# EAGLE schematic PDP8S (EAGLE 6.6.0)

## Sheet 1 of 2
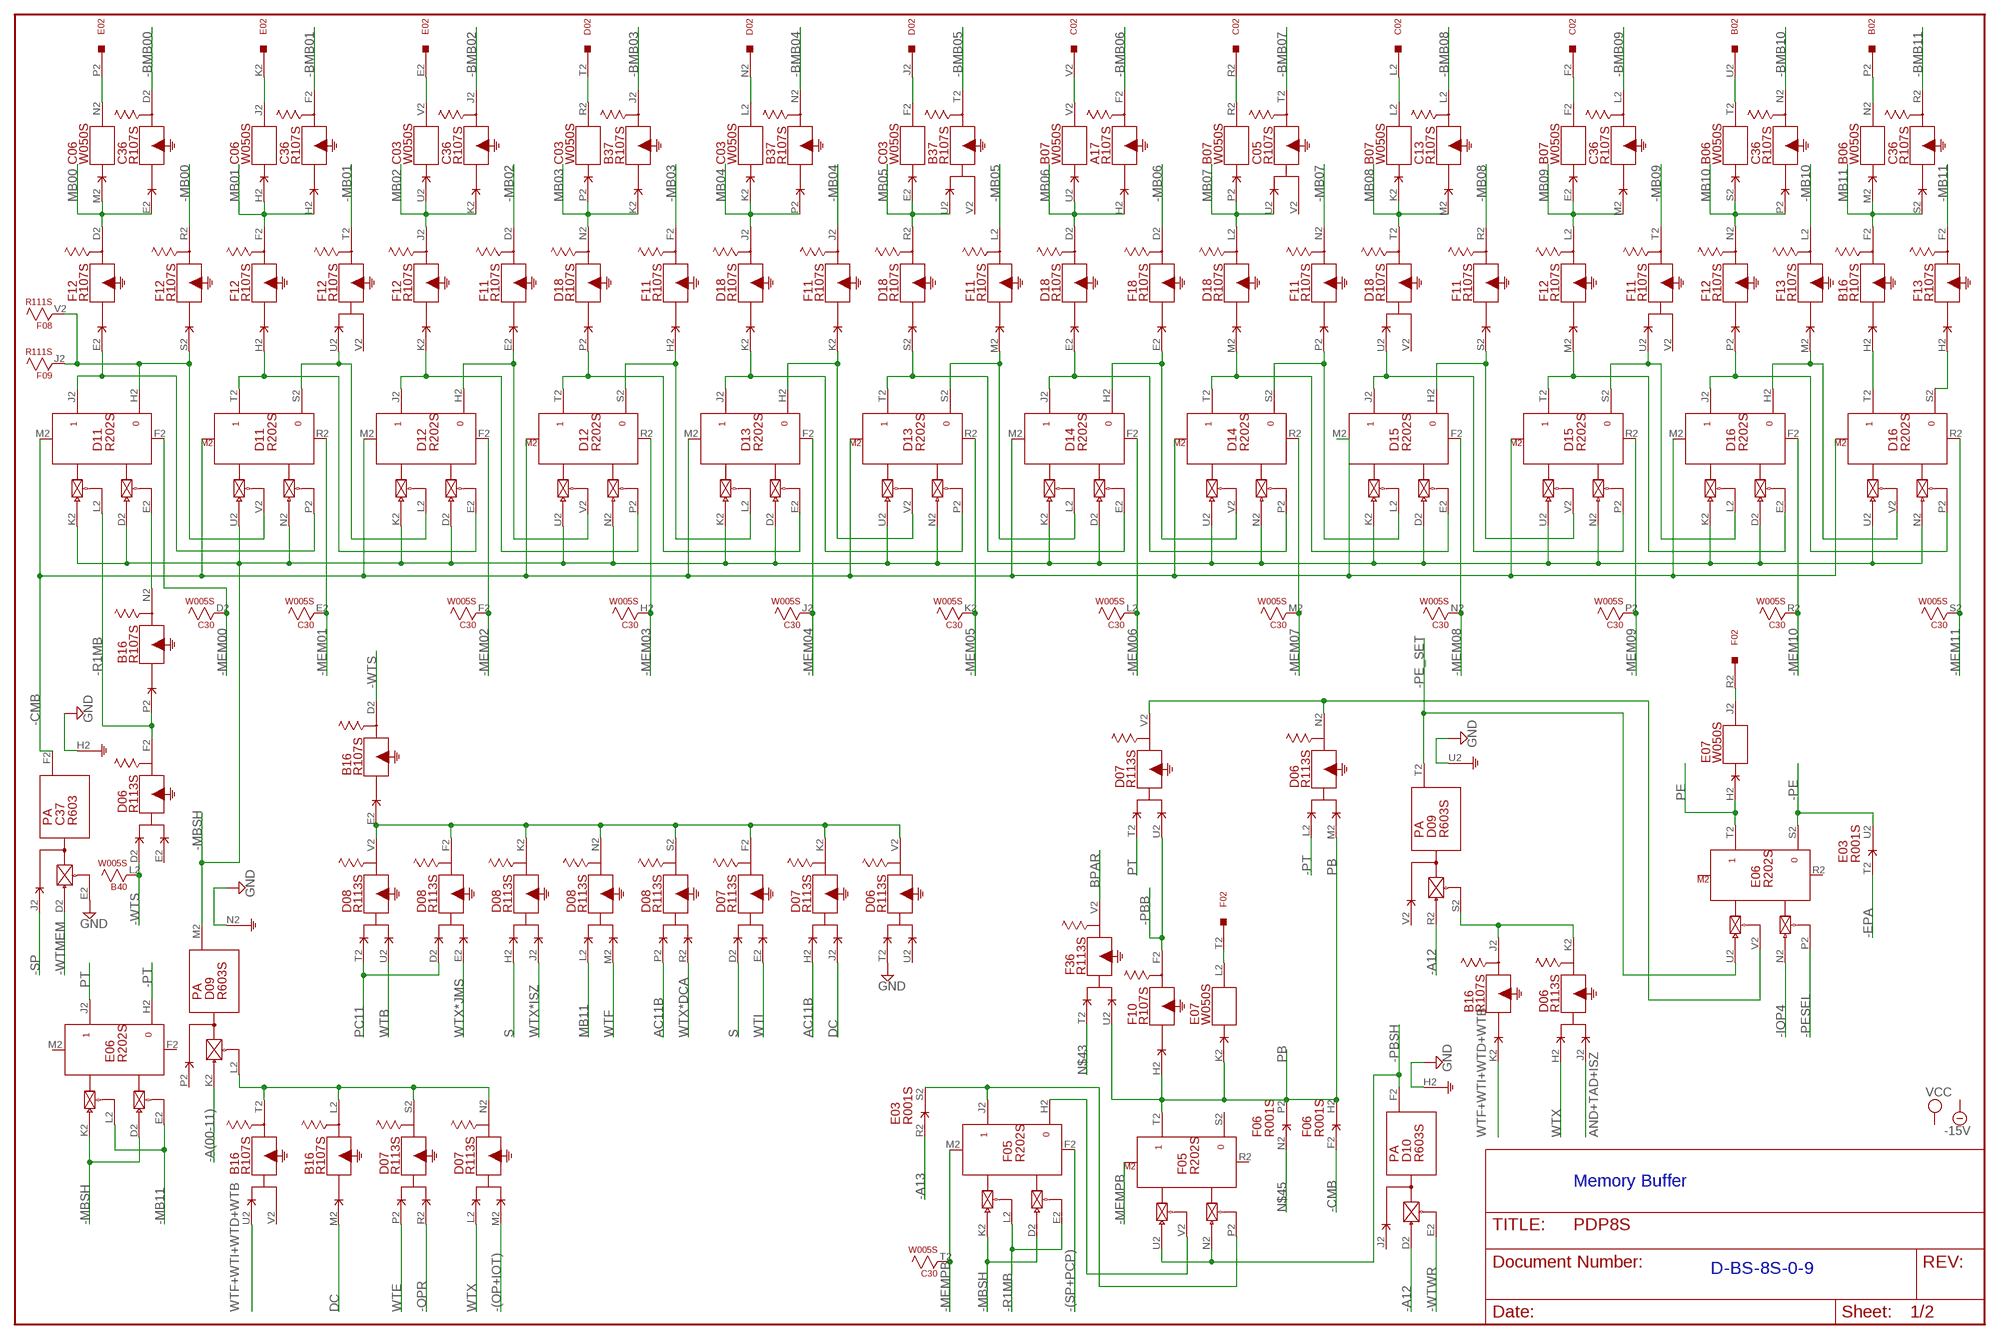
[diagram p0: schematic, sheet 1]

### Parts
A17  R107S  [H807S]
B02  W023S  [H807S]
B06  W050S  [H807S]
B07  W050S  [H807S]
B16  R107S  [H807S]
B37  R107S  [H807S]
B40  W005S  [H807S]
C02  W023S  [H807S]
C03  W050S  [H807S]
C05  R107S  [H807S]
C06  W050S  [H807S]
C13  R107S  [H807S]
C30  W005S  [H807S]
C36  R107S  [H807S]
C37  R603  [H807]
D02  W023S  [H807S]
D06  R113S  [H807S]
D07  R113S  [H807S]
D08  R113S  [H807S]
D09  R603S  [H807S]
D10  R603S  [H807S]
D11  R202S  [H807S]
D12  R202S  [H807S]
D13  R202S  [H807S]
D14  R202S  [H807S]
D15  R202S  [H807S]
D16  R202S  [H807S]
D18  R107S  [H807S]
E02  W023S  [H807S]
E03  R001S  [H807S]
E06  R202S  [H807S]
E07  W050S  [H807S]
F02  W023S  [H807S]
F05  R202S  [H807S]
F06  R001S  [H807S]
F08  R111S  [H807S]
F09  R111S  [H807S]
F10  R107S  [H807S]
F11  R107S  [H807S]
F12  R107S  [H807S]
F13  R107S  [H807S]
F18  R107S  [H807S]
F36  R113S  [H807S]

### Nets
-(OP+IOT): D07.M2(N:I$2)
-(SP+PCP): F05.F2(J:RESET)
-A12: D09.R2(T:PU0) D10.D2(F:PU0)
-A13: E03.R2(S:D)
-A(00-11): D09.K2(M:PU0)
-BMB00: C36.D2(D:O$1)
-BMB01: C36.F2(F:O$1)
-BMB02: C36.J2(J:O$1)
-BMB03: B37.J2(J:O$1)
-BMB04: B37.N2(N:O$1)
-BMB05: B37.T2(T:O$1)
-BMB06: A17.F2(F:O$1)
-BMB07: C05.T2(T:O$1)
-BMB08: C13.L2(L:O$1)
-BMB09: C36.L2(L:O$1)
-BMB10: C36.N2(N:O$1)
-BMB11: C36.R2(R:O$1)
-CMB: C37.F2(F:O) D11.M2(J:SET) D12.M2(J:SET) D13.M2(J:SET) D14.M2(J:SET) D15.M2(J:SET) D16.M2(J:SET) F06.F2(H:D)
-EPA: E03.T2(U:D)
-IOP4: E06.N2(T:PU0)
-MB00: F12.R2(R:O$1)
-MB01: F12.T2(T:O$1)
-MB02: F11.D2(D:O$1)
-MB03: F11.F2(F:O$1)
-MB04: F11.J2(J:O$1)
-MB05: F11.L2(L:O$1)
-MB06: F18.D2(D:O$1)
-MB07: F11.N2(N:O$1)
-MB08: F11.R2(R:O$1)
-MB09: F11.T2(T:O$1)
-MB10: F13.L2(L:O$1)
-MB11: E06.E2(J:EN0) E06.L2(J:EN1) F13.F2(F:O$1)
-MBSH: D09.M2(M:O) D11.D2(J:PU0) D11.K2(J:PU1) D11.N2(T:PU0) D11.U2(T:PU1) D12.D2(J:PU0) D12.K2(J:PU1) D12.N2(T:PU0) D12.U2(T:PU1) D13.D2(J:PU0) D13.K2(J:PU1) D13.N2(T:PU0) D13.U2(T:PU1) D14.D2(J:PU0) D14.K2(J:PU1) D14.N2(T:PU0) D14.U2(T:PU1) D15.D2(J:PU0) D15.K2(J:PU1) D15.N2(T:PU0) D15.U2(T:PU1) D16.D2(J:PU0) D16.K2(J:PU1) D16.N2(T:PU0) D16.U2(T:PU1) E06.D2(J:PU0) E06.K2(J:PU1) F05.D2(J:PU0) F05.K2(J:PU1)
-MEM00: C30.D2 D11.F2(J:RESET)
-MEM01: C30.E2 D11.R2(T:RESET)
-MEM02: C30.F2 D12.F2(J:RESET)
-MEM03: C30.H2 D12.R2(T:RESET)
-MEM04: C30.J2 D13.F2(J:RESET)
-MEM05: C30.K2 D13.R2(T:RESET)
-MEM06: C30.L2 D14.F2(J:RESET)
-MEM07: C30.M2 D14.R2(T:RESET)
-MEM08: C30.N2 D15.F2(J:RESET)
-MEM09: C30.P2 D15.R2(T:RESET)
-MEM10: C30.R2 D16.F2(J:RESET)
-MEM11: C30.S2 D16.R2(T:RESET)
-MEMPB: C30.T2 F05.M2(J:SET)
-OPR: D07.R2(S:I$2)
-PBB: D07.U2(V:I$2) F10.F2(F:O$1)
-PBSH: D10.F2(F:O) F05.N2(T:PU0) F05.U2(T:PU1)
-PE: E03.U2(U:E) E06.S2
-PE_SET: D09.T2(T:O) E06.U2(T:PU1)
-PESEL: E06.P2(T:EN0)
-PT: D06.L2(N:I$1) E06.H2
-R1MB: B16.P2(N:I$1) D06.F2(F:O$1) D11.L2(J:EN1) F05.E2(J:EN0) F05.L2(J:EN1)
-SP: C37.J2(F:I$1)
-WTMEM: C37.D2(F:PU0)
-WTS: B16.D2(D:O$1) B40.L2 D06.D2(F:I$1)
-WTWR: D10.E2(F:EN0)
AC11B: D07.H2(K:I$1) D08.P2(S:I$1)
AND+TAD+ISZ: D06.J2(K:I$2)
BPAR: F36.V2(V:O$1)
DC: B16.M2(L:I$1) D07.J2(K:I$2)
GND [Supply]: C37.E2(F:EN0) C37.H2(F:G) D06.T2(V:I$1) D09.N2(M:G) D09.U2(T:G) D10.H2(F:G)
MB00: C06.M2(N:I$1) C36.E2(D:I$1) F12.D2(D:O$1)
MB01: C06.H2(J:I$1) C36.H2(F:I$1) F12.F2(F:O$1)
MB02: C03.U2(V:I$1) C36.K2(J:I$1) F12.J2(J:O$1)
MB03: B37.K2(J:I$1) C03.P2(R:I$1) D18.N2(N:O$1)
MB04: B37.P2(N:I$1) C03.K2(L:I$1) D18.J2(J:O$1)
MB05: B37.U2(T:I$1) C03.E2(F:I$1) D18.R2(R:O$1)
MB06: A17.H2(F:I$1) B07.U2(V:I$1) D18.D2(D:O$1)
MB07: B07.P2(R:I$1) C05.U2(T:I$1) D18.L2(L:O$1)
MB08: B07.K2(L:I$1) C13.M2(L:I$1) D18.T2(T:O$1)
MB09: B07.E2(F:I$1) C36.M2(L:I$1) F12.L2(L:O$1)
MB10: B06.S2(T:I$1) C36.P2(N:I$1) F12.N2(N:O$1)
MB11: B06.M2(N:I$1) B16.F2(F:O$1) C36.S2(R:I$1) D08.L2(N:I$1)
N$1: D11.J2 D11.P2(T:EN0) F12.E2(D:I$1)
N$2: C06.N2(N:O$1) E02.P2
N$3: D11.H2 D11.V2(T:EN1) F08.V2 F09.J2 F12.S2(R:I$1)
N$4: D11.T2 D12.E2(J:EN0) F12.H2(F:I$1)
N$5: B16.E2(D:I$1) D06.V2(V:O$1) D07.F2(F:O$1) D07.K2(K:O$1) D08.F2(F:O$1) D08.K2(K:O$1) D08.N2(N:O$1) D08.S2(S:O$1) D08.V2(V:O$1)
N$6: D12.J2 D12.P2(T:EN0) F12.K2(J:I$1)
N$7: D12.T2 D13.E2(J:EN0) D18.P2(N:I$1)
N$8: D13.J2 D13.P2(T:EN0) D18.K2(J:I$1)
N$9: D13.T2 D14.E2(J:EN0) D18.S2(R:I$1)
N$10: D14.J2 D14.P2(T:EN0) D18.E2(D:I$1)
N$11: D14.T2 D15.E2(J:EN0) D18.M2(L:I$1)
N$12: D15.J2 D15.P2(T:EN0) D18.U2(T:I$1)
N$13: D15.H2 D15.V2(T:EN1) F11.S2(R:I$1)
N$14: D14.S2 D15.L2(J:EN1) F11.P2(N:I$1)
N$15: D14.H2 D14.V2(T:EN1) F18.E2(D:I$1)
N$16: D13.S2 D14.L2(J:EN1) F11.M2(L:I$1)
N$17: D15.T2 D16.E2(J:EN0) F12.M2(L:I$1)
N$18: D15.S2 D16.L2(J:EN1) F11.U2(T:I$1)
N$19: D16.J2 D16.P2(T:EN0) F12.P2(N:I$1)
N$20: D13.H2 D13.V2(T:EN1) F11.K2(J:I$1)
N$21: D12.S2 D13.L2(J:EN1) F11.H2(F:I$1)
N$22: D12.H2 D12.V2(T:EN1) F11.E2(D:I$1)
N$23: D11.S2 D12.L2(J:EN1) F12.U2(T:I$1)
N$24: D16.H2 D16.V2(T:EN1) F13.M2(L:I$1)
N$25: B16.H2(F:I$1) D16.T2
N$26: D16.S2 F13.H2(F:I$1)
N$27: C06.J2(J:O$1) E02.K2
N$28: C03.V2(V:O$1) E02.E2
N$29: C03.R2(R:O$1) D02.T2
N$30: C03.L2(L:O$1) D02.N2
N$31: C03.F2(F:O$1) D02.J2
N$32: B07.V2(V:O$1) C02.V2
N$33: B07.R2(R:O$1) C02.R2
N$34: B07.L2(L:O$1) C02.L2
N$35: B07.F2(F:O$1) C02.F2
N$36: B02.U2 B06.T2(T:O$1)
N$37: B02.P2 B06.N2(N:O$1)
N$38: B16.L2(L:O$1) B16.T2(T:O$1) D07.N2(N:O$1) D07.S2(S:O$1) D09.L2(M:EN0)
N$39: B16.N2(N:O$1) D11.E2(J:EN0)
N$40: B16.J2(J:O$1) D06.K2(K:O$1) D09.S2(T:EN0)
N$41: E07.J2(J:O$1) F02.R2
N$42: D06.N2(N:O$1) D07.V2(V:O$1) E06.V2(T:EN1)
N$43: F36.T2(V:I$1)
N$44: E07.L2(L:O$1) F02.T2
N$45: F06.N2(P:D)
N$46: F05.H2 F05.V2(T:EN1)
N$47: E03.S2(S:E) F05.J2 F05.P2(T:EN0)
PB: D06.M2(N:I$2) E07.K2(L:I$1) F05.T2 F06.H2(H:E) F06.P2(P:E) F10.H2(F:I$1) F36.U2(V:I$2)
PC11: D08.D2(F:I$1) D08.T2(V:I$1)
PE: E06.T2 E07.H2(J:I$1)
PT: D07.T2(V:I$1) E06.J2
S: D07.D2(F:I$1) D08.H2(K:I$1)
WTB: D08.U2(V:I$2)
WTE: D07.P2(S:I$1)
WTF: D08.M2(N:I$2)
WTF+WTI+WTD+WTB: B16.K2(J:I$1) B16.U2(T:I$1)
WTI: D07.E2(F:I$2)
WTX: D06.H2(K:I$1) D07.L2(N:I$1)
WTX*DCA: D08.R2(S:I$2)
WTX*ISZ: D08.J2(K:I$2)
WTX*JMS: D08.E2(F:I$2)
Unconnected: A17.D2(D:O$1) A17.E2(D:I$1) A17.J2(J:O$1) A17.K2(J:I$1) A17.L2(L:O$1) A17.M2(L:I$1) A17.N2(N:O$1) A17.P2(N:I$1) A17.R2(R:O$1) A17.S2(R:I$1) A17.T2(T:O$1) A17.U2(T:I$1) A17.V2(T:I$2) B02.A2 B02.B2 B02.C2 B02.D2 B02.E2 B02.F2 B02.H2 B02.J2 B02.K2 B02.L2 B02.M2 B02.N2 B02.R2 B02.S2 B02.T2 B02.V2 B06.E2(F:I$1) B06.F2(F:O$1) B06.H2(J:I$1) B06.J2(J:O$1) B06.K2(L:I$1) B06.L2(L:O$1) B06.P2(R:I$1) B06.R2(R:O$1) B06.U2(V:I$1) B06.V2(V:O$1) B07.H2(J:I$1) B07.J2(J:O$1) B07.M2(N:I$1) B07.N2(N:O$1) B07.S2(T:I$1) B07.T2(T:O$1) B16.R2(R:O$1) B16.S2(R:I$1) B16.V2(T:I$2) B37.D2(D:O$1) B37.E2(D:I$1) B37.F2(F:O$1) B37.H2(F:I$1) B37.L2(L:O$1) B37.M2(L:I$1) B37.R2(R:O$1) B37.S2(R:I$1) B37.V2(T:I$2) B40.D2 B40.E2 B40.F2 B40.H2 B40.J2 B40.K2 B40.M2 B40.N2 B40.P2 B40.R2 B40.S2 B40.T2 B40.U2 B40.V2 C02.A2 C02.B2 C02.C2 C02.D2 C02.E2 C02.H2 C02.J2 C02.K2 C02.M2 C02.N2 C02.P2 C02.S2 C02.T2 C02.U2 C03.H2(J:I$1) C03.J2(J:O$1) C03.M2(N:I$1) C03.N2(N:O$1) C03.S2(T:I$1) C03.T2(T:O$1) C05.D2(D:O$1) C05.E2(D:I$1) C05.F2(F:O$1) C05.H2(F:I$1) C05.J2(J:O$1) C05.K2(J:I$1) C05.L2(L:O$1) C05.M2(L:I$1) C05.N2(N:O$1) C05.P2(N:I$1) C05.R2(R:O$1) C05.S2(R:I$1) C05.V2(T:I$2) C06.E2(F:I$1) C06.F2(F:O$1) C06.K2(L:I$1) C06.L2(L:O$1) C06.P2(R:I$1) C06.R2(R:O$1) C06.S2(T:I$1) C06.T2(T:O$1) C06.U2(V:I$1) C06.V2(V:O$1) C13.D2(D:O$1) C13.E2(D:I$1) C13.F2(F:O$1) C13.H2(F:I$1) C13.J2(J:O$1) C13.K2(J:I$1) C13.N2(N:O$1) C13.P2(N:I$1) C13.R2(R:O$1) C13.S2(R:I$1) C13.T2(T:O$1) C13.U2(T:I$1) C13.V2(T:I$2) C30.U2 C30.V2 C36.T2(T:O$1) C36.U2(T:I$1) C36.V2(T:I$2) C37.K2(M:PU0) C37.L2(M:EN0) C37.M2(M:O) C37.N2(M:G) C37.P2(M:I$1) C37.R2(T:PU0) C37.S2(T:EN0) C37.T2(T:O) C37.U2(T:G) C37.V2(T:I$1) D02.A2 D02.B2 D02.C2 D02.D2 D02.E2 D02.F2 D02.H2 D02.K2 D02.L2 D02.M2 D02.P2 D02.R2 D02.S2 D02.U2 D02.V2 D06.E2(F:I$2) D06.P2(S:I$1) D06.R2(S:I$2) D06.S2(S:O$1) D06.U2(V:I$2) D09.D2(F:PU0) D09.E2(F:EN0) D09.F2(F:O) D09.H2(F:G) D09.J2(F:I$1) D09.P2(M:I$1) D09.V2(T:I$1) D10.J2(F:I$1) D10.K2(M:PU0) D10.L2(M:EN0) D10.M2(M:O) D10.N2(M:G) D10.P2(M:I$1) D10.R2(T:PU0) D10.S2(T:EN0) D10.T2(T:O) D10.U2(T:G) D10.V2(T:I$1) D18.F2(F:O$1) D18.H2(F:I$1) D18.V2(T:I$2) E02.A2 E02.B2 E02.C2 E02.D2 E02.F2 E02.H2 E02.J2 E02.L2 E02.M2 E02.N2 E02.R2 E02.S2 E02.T2 E02.U2 E02.V2 E03.D2(E:D) E03.E2(E:E) E03.F2(H:D) E03.H2(H:E) E03.J2(K:D) E03.K2(K:E) E03.L2(M:D) E03.M2(M:E) E03.N2(P:D) E03.P2(P:E) E06.F2(J:RESET) E06.M2(J:SET) E06.R2(T:RESET) E07.E2(F:I$1) E07.F2(F:O$1) E07.M2(N:I$1) E07.N2(N:O$1) E07.P2(R:I$1) E07.R2(R:O$1) E07.S2(T:I$1) E07.T2(T:O$1) E07.U2(V:I$1) E07.V2(V:O$1) F02.A2 F02.B2 F02.C2 F02.D2 F02.E2 F02.F2 F02.H2 F02.J2 F02.K2 F02.L2 F02.M2 F02.N2 F02.P2 F02.S2 F02.U2 F02.V2 F05.R2(T:RESET) F05.S2 F06.D2(E:D) F06.E2(E:E) F06.J2(K:D) F06.K2(K:E) F06.L2(M:D) F06.M2(M:E) F06.R2(S:D) F06.S2(S:E) F06.T2(U:D) F06.U2(U:E) F08.D2(H:I$1) F08.E2(H:I$2) F08.F2(H:I$3) F08.H2(H:O$1) F08.J2 F08.K2(N:I$1) F08.L2(N:I$2) F08.M2(N:I$3) F08.N2(N:O$1) F08.P2 F08.R2(U:I$1) F08.S2(U:I$2) F08.T2(U:I$3) F08.U2(U:O$1) F09.D2(H:I$1) F09.E2(H:I$2) F09.F2(H:I$3) F09.H2(H:O$1) F09.K2(N:I$1) F09.L2(N:I$2) F09.M2(N:I$3) F09.N2(N:O$1) F09.P2 F09.R2(U:I$1) F09.S2(U:I$2) F09.T2(U:I$3) F09.U2(U:O$1) F09.V2 F10.D2(D:O$1) F10.E2(D:I$1) F10.J2(J:O$1) F10.K2(J:I$1) F10.L2(L:O$1) F10.M2(L:I$1) F10.N2(N:O$1) F10.P2(N:I$1) F10.R2(R:O$1) F10.S2(R:I$1) F10.T2(T:O$1) F10.U2(T:I$1) F10.V2(T:I$2) F11.V2(T:I$2) F12.V2(T:I$2) F13.D2(D:O$1) F13.E2(D:I$1) F13.J2(J:O$1) F13.K2(J:I$1) F13.N2(N:O$1) F13.P2(N:I$1) F13.R2(R:O$1) F13.S2(R:I$1) F13.T2(T:O$1) F13.U2(T:I$1) F13.V2(T:I$2) F18.F2(F:O$1) F18.H2(F:I$1) F18.J2(J:O$1) F18.K2(J:I$1) F18.L2(L:O$1) F18.M2(L:I$1) F18.N2(N:O$1) F18.P2(N:I$1) F18.R2(R:O$1) F18.S2(R:I$1) F18.T2(T:O$1) F18.U2(T:I$1) F18.V2(T:I$2) F36.D2(F:I$1) F36.E2(F:I$2) F36.F2(F:O$1) F36.H2(K:I$1) F36.J2(K:I$2) F36.K2(K:O$1) F36.L2(N:I$1) F36.M2(N:I$2) F36.N2(N:O$1) F36.P2(S:I$1) F36.R2(S:I$2) F36.S2(S:O$1)

### Notes on the sheet
- Memory Buffer
- D-BS-8S-0-9

## Sheet 2 of 2
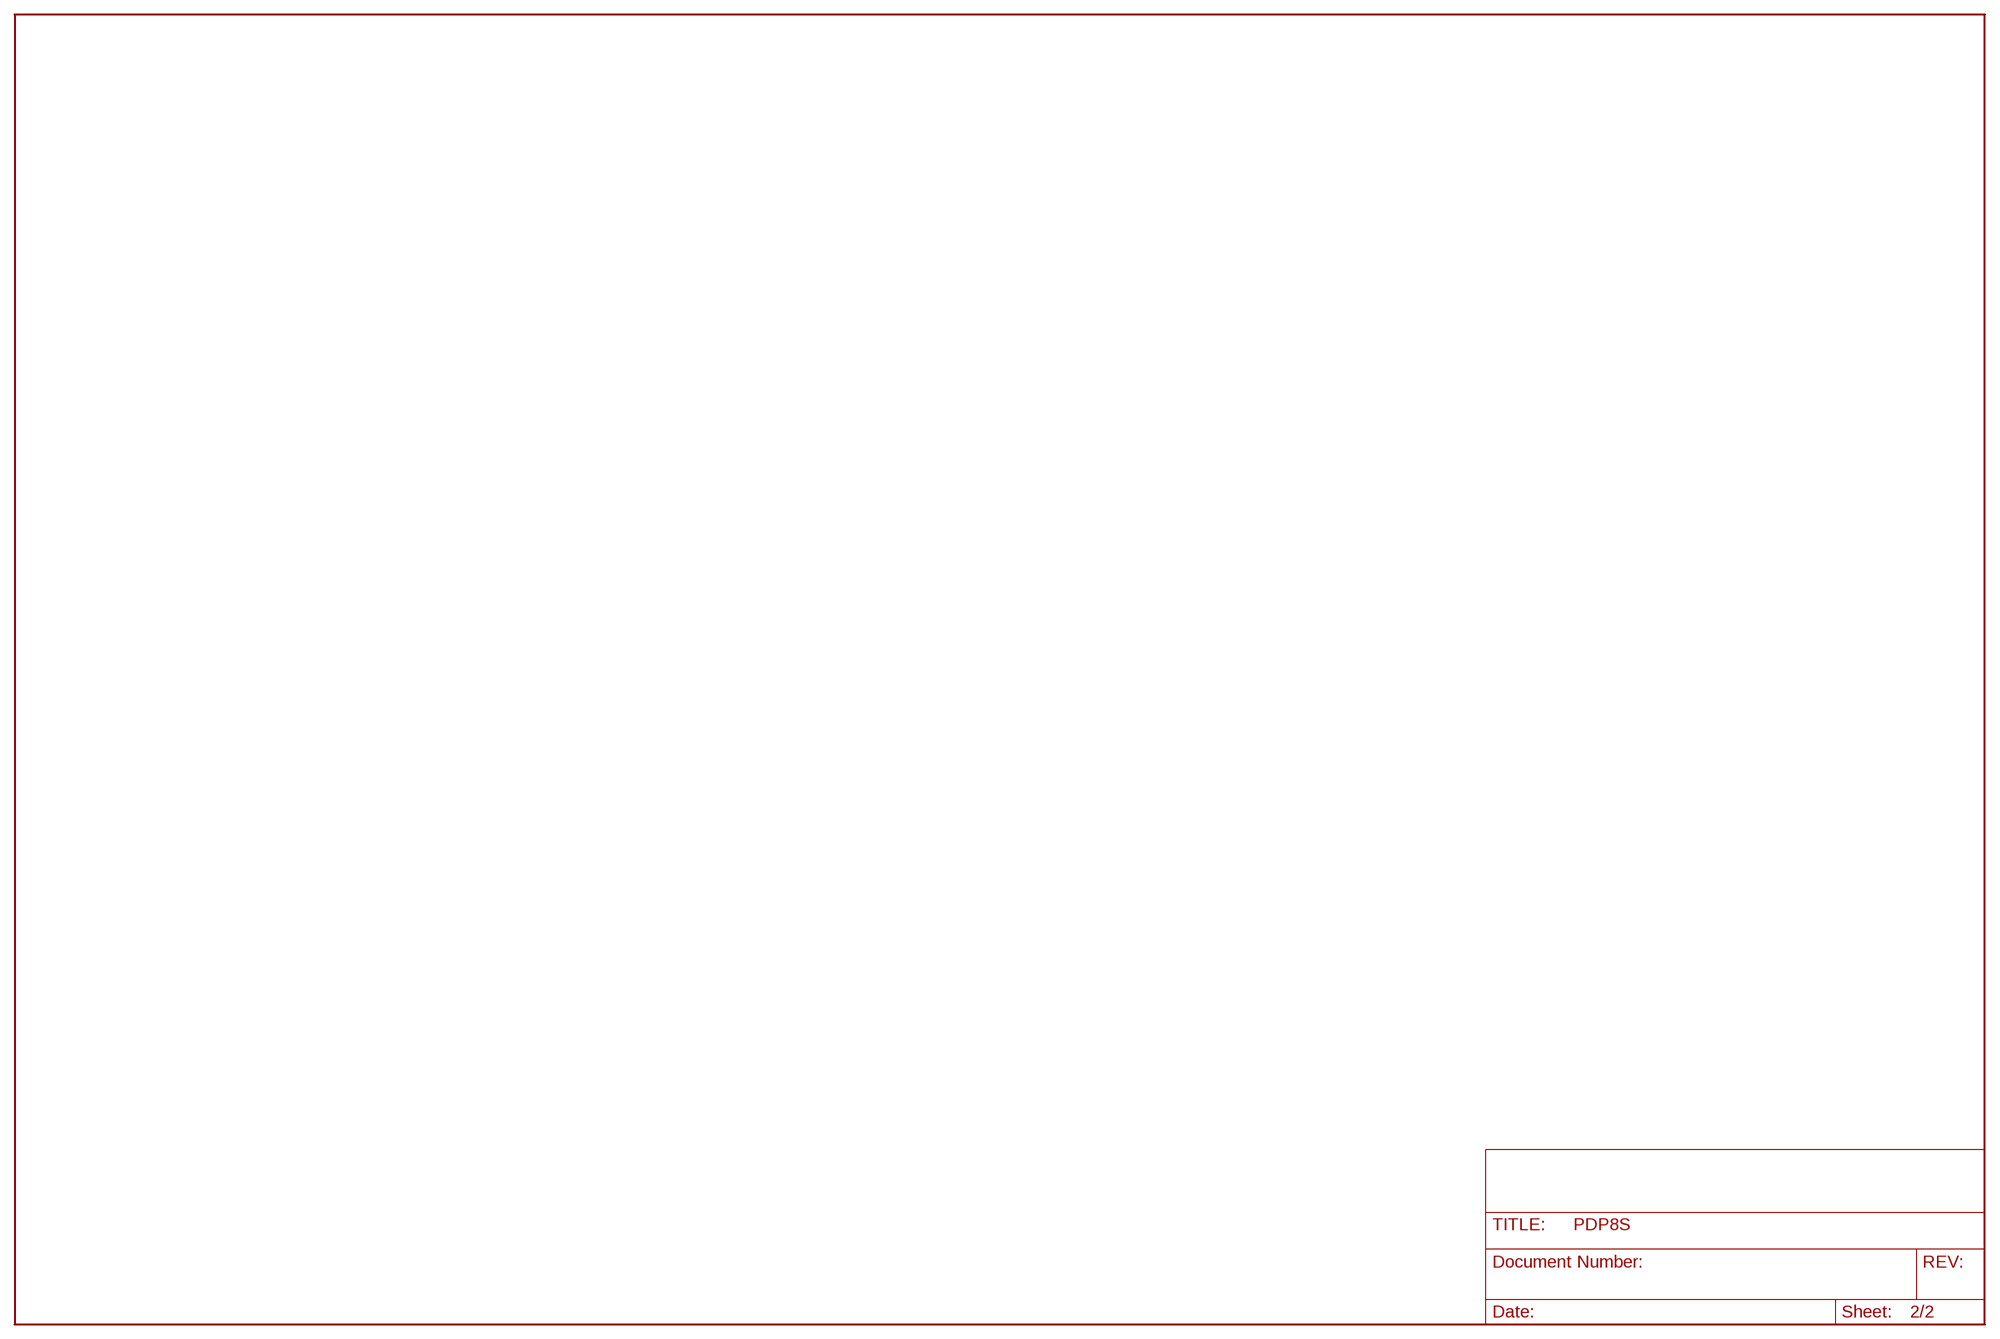
[diagram p1: schematic, sheet 2]

## Power pins joined to a net without a drawn wire
-15V: A17.B2(-15V) B06.B2(-15V) B07.B2(-15V) B16.B2(-15V) B37.B2(-15V) B40.B2(-15V) C03.B2(-15V) C05.B2(-15V) C06.B2(-15V) C13.B2(-15V) C30.B2(-15V) C36.B2(-15V) C37.B2(-15V) D06.B2(-15V) D07.B2(-15V) D08.B2(-15V) D09.B2(-15V) D10.B2(-15V) D11.B2(-15V) D12.B2(-15V) D13.B2(-15V) D14.B2(-15V) D15.B2(-15V) D16.B2(-15V) D18.B2(-15V) E03.B2(-15V) E06.B2(-15V) E07.B2(-15V) F05.B2(-15V) F06.B2(-15V) F08.B2(-15V) F09.B2(-15V) F10.B2(-15V) F11.B2(-15V) F12.B2(-15V) F13.B2(-15V) F18.B2(-15V) F36.B2(-15V)
GND: A17.C2(GND) B06.C2(GND) B07.C2(GND) B16.C2(GND) B37.C2(GND) B40.C2(GND) C03.C2(GND) C05.C2(GND) C06.C2(GND) C13.C2(GND) C30.C2(GND) C36.C2(GND) C37.C2(GND) D06.C2(GND) D07.C2(GND) D08.C2(GND) D09.C2(GND) D10.C2(GND) D11.C2(GND) D12.C2(GND) D13.C2(GND) D14.C2(GND) D15.C2(GND) D16.C2(GND) D18.C2(GND) E03.C2(GND) E06.C2(GND) E07.C2(GND) F05.C2(GND) F06.C2(GND) F08.C2(GND) F09.C2(GND) F10.C2(GND) F11.C2(GND) F12.C2(GND) F13.C2(GND) F18.C2(GND) F36.C2(GND)
VCC: A17.A2(VCC) B06.A2(VCC) B07.A2(VCC) B16.A2(VCC) B37.A2(VCC) B40.A2(VCC) C03.A2(VCC) C05.A2(VCC) C06.A2(VCC) C13.A2(VCC) C30.A2(VCC) C36.A2(VCC) C37.A2(VCC) D06.A2(VCC) D07.A2(VCC) D08.A2(VCC) D09.A2(VCC) D10.A2(VCC) D11.A2(VCC) D12.A2(VCC) D13.A2(VCC) D14.A2(VCC) D15.A2(VCC) D16.A2(VCC) D18.A2(VCC) E03.A2(VCC) E06.A2(VCC) E07.A2(VCC) F05.A2(VCC) F06.A2(VCC) F08.A2(VCC) F09.A2(VCC) F10.A2(VCC) F11.A2(VCC) F12.A2(VCC) F13.A2(VCC) F18.A2(VCC) F36.A2(VCC)

## Library data of the parts
A17 B16 B37 C05 C13 C36 D18 F10-F13 F18 = dec-m:R107: 7 Inverters
B02 C02 D02 E02 F02 = dec-m:W023: One-sided 18 pin connector/cable.
B06 B07 C03 C06 E07 = dec-m:W050: Indicator Driver
B40 C30 = dec-m:W005: 15 Clamped Loads
C37 D09 D10 = dec-m:R603: Triple Pulse Amplifier
D06-D08 F36 = dec-m:R113: Diode Gate
D11-D16 E06 F05 = dec-m:R202: Dual Flip-Flop
E03 F06 = dec-m:R001: 7 Diodes
F08 F09 = dec-m:R111: Diode Gate

## Net classes
1 Supply: width 0.635 mm